# EasyEDA schematic SCH_U-Blox Neo shield for Wemos D1 Mini_2022-02-07.json
TITLE: Sheet_1; REV: 3.0; Date: 2020-07-20; Sheet: 1/1; Drawn By: Danisimo; Company: Your Company
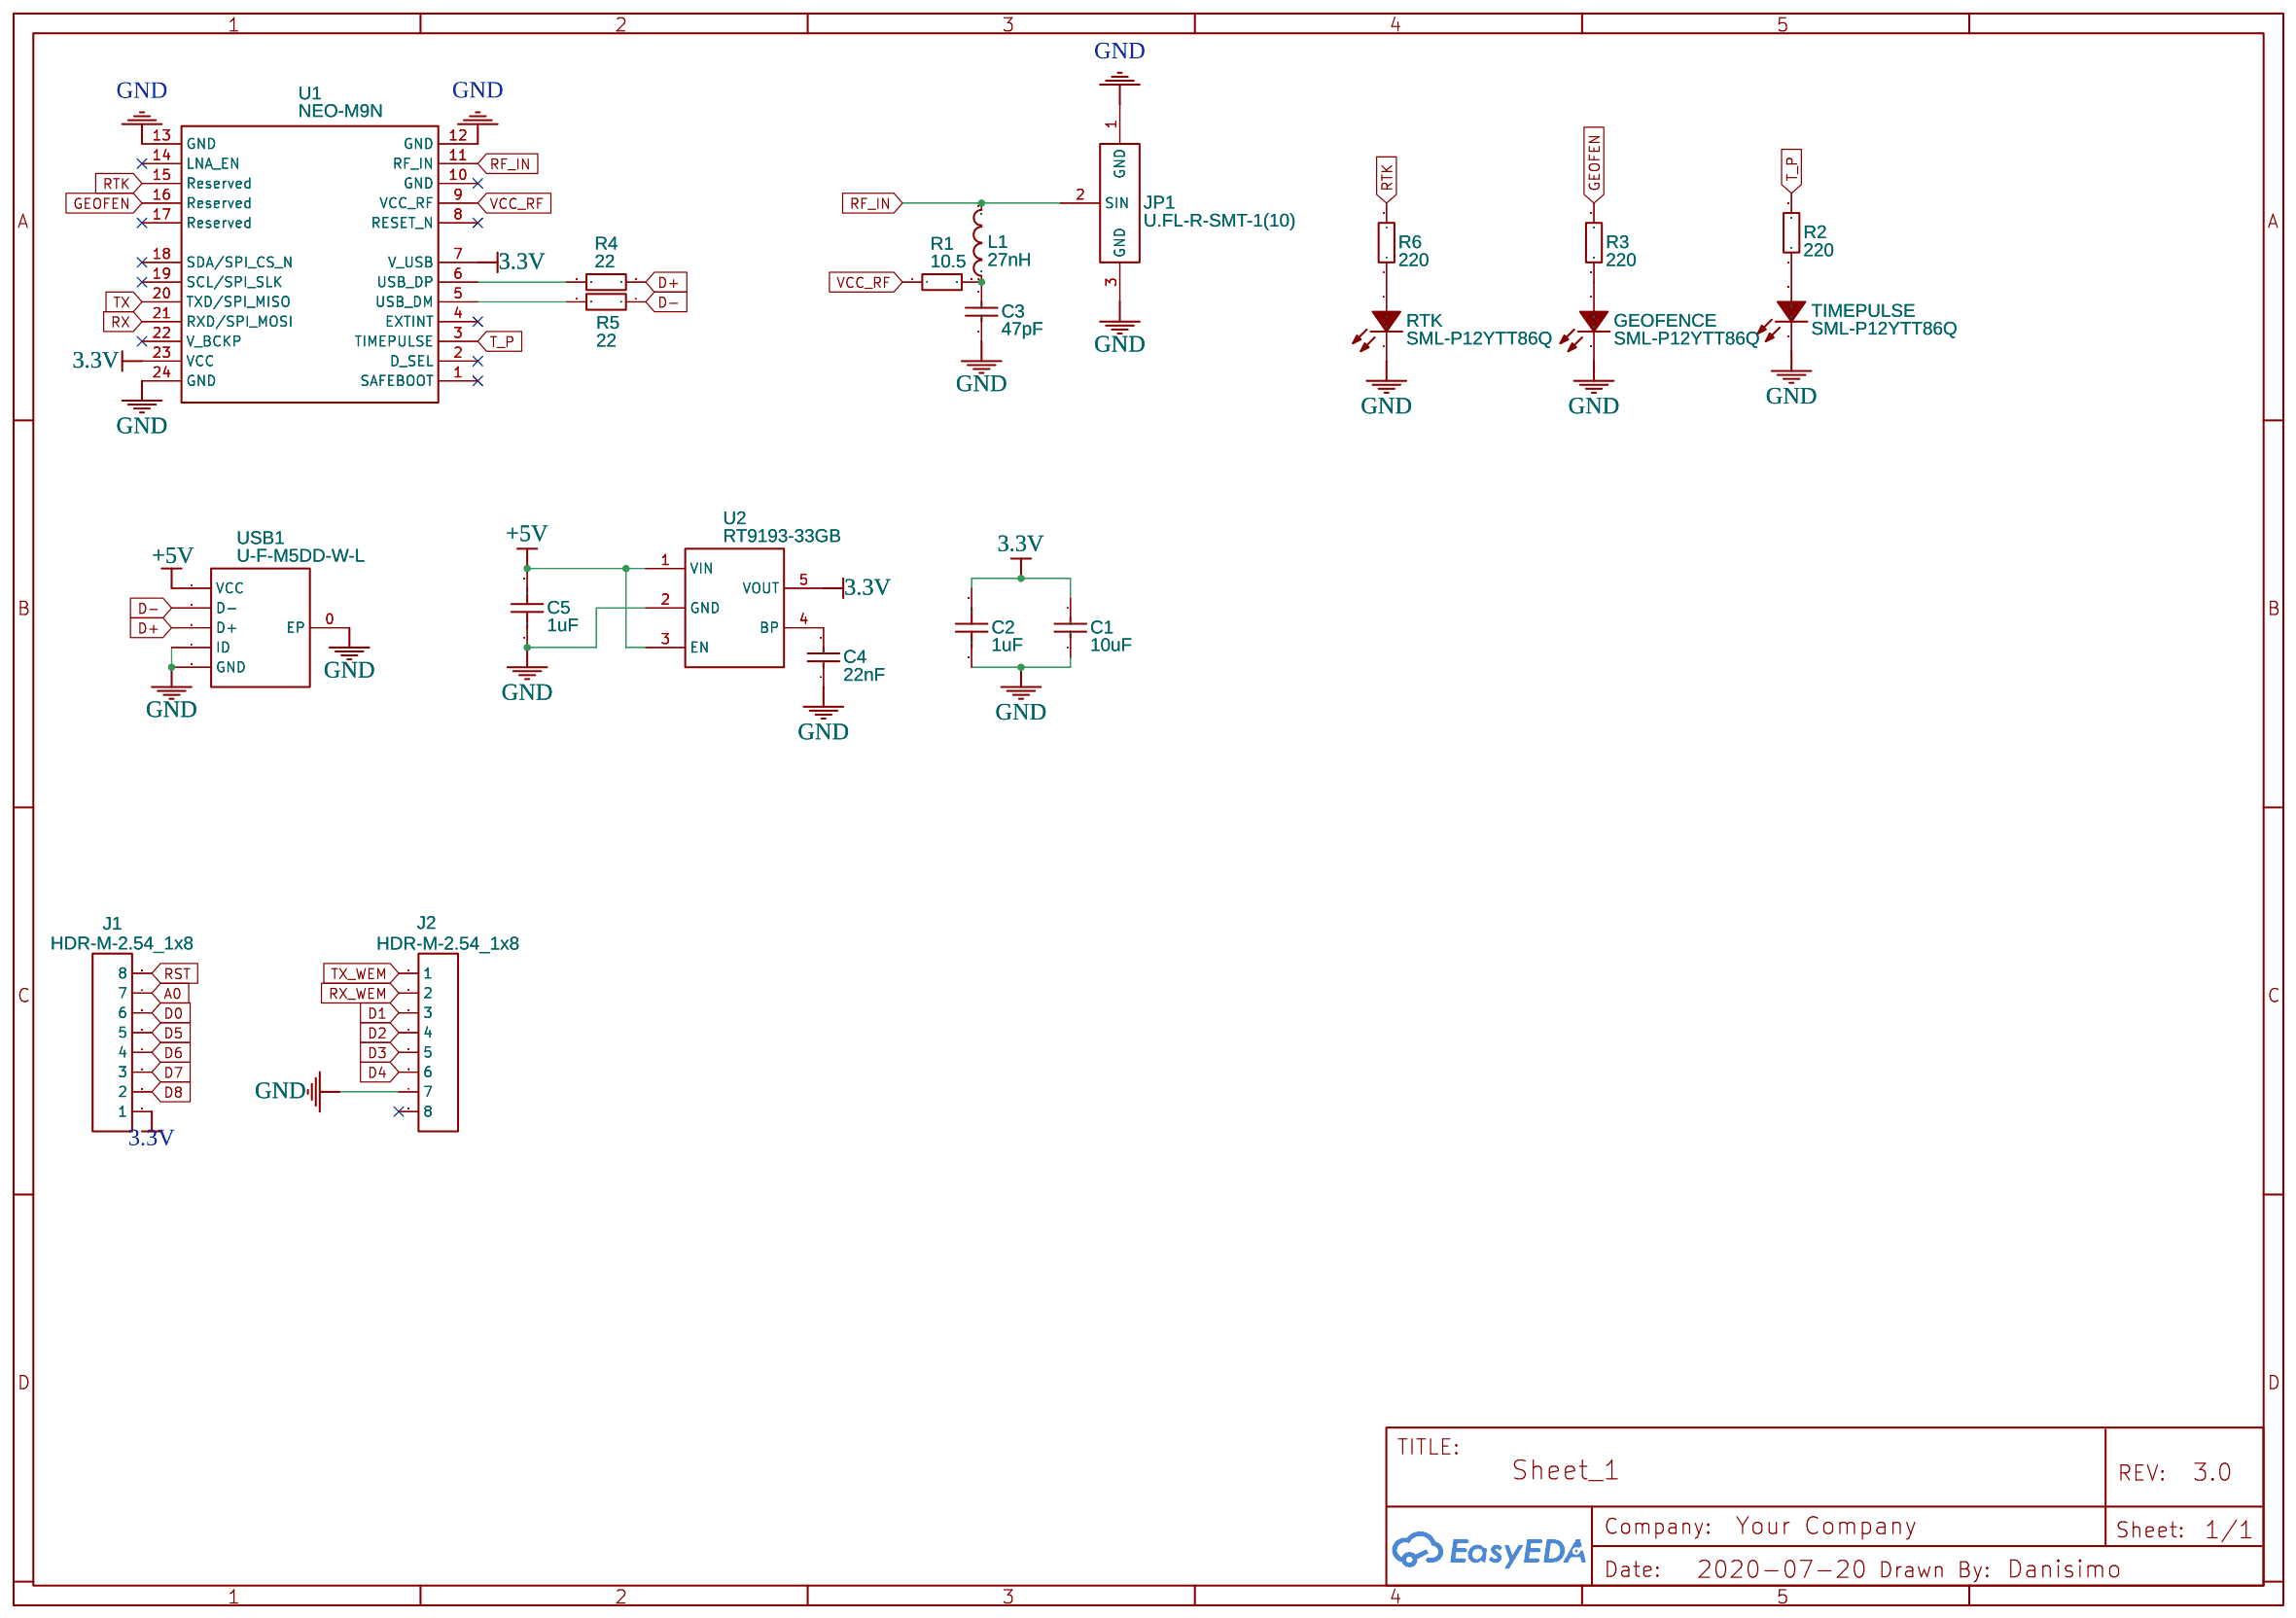
[diagram p0: schematic sheet]

## Parts
C1  10uF  [C0402]
C2  1uF  [C0402]
C3  47pF  [C0402]
C4  22nF  [C0402]
C5  1uF  [C0402]
GEOFENCE  SML-P12YTT86Q  [LED0402-RD]
J1  HDR-M-2.54_1x8  [HDR-M-2.54_1X8]
J2  HDR-M-2.54_1x8  [HDR-M-2.54_1X8]
JP1  U.FL-R-SMT-1(10)  [ANT-SMD_UFL-R-SMT-1(10)]
L1  27nH  [L0402]
R1  10.5  [R0603]
R2  220  [R0402]
R3  220  [R0402]
R4  22  [R0402]
R5  22  [R0402]
R6  220  [R0402]
RTK  SML-P12YTT86Q  [LED0402-RD]
TIMEPULSE  SML-P12YTT86Q  [LED0402-RD]
U1  NEO-M9N  [NEO-M9N]
U2  RT9193-33GB  [SOT-23-5_L3.0-W1.7-P0.95-LS2.8-BR]
USB1  U-F-M5DD-W-L  [MICRO-USB-SMD_MICRO-USB-18]

## Library data of the parts
C1 = CL05A106MQ5NUNC: Supplier: LCSC; Manufacturer: SAMSUNG; LCSC Assembly: Yes; Supplier Part: C15525; SMT Type: Basic
C2 C5 = CL05A105KA5NQNC: Supplier: LCSC; Manufacturer: SAMSUNG; LCSC Assembly: Yes; Supplier Part: C52923; SMT Type: Basic
C3 = 0402CG470J500NT: Supplier: LCSC; Manufacturer: FH; LCSC Assembly: Yes; Supplier Part: C1567; SMT Type: Basic
C4 = 0402B223K500NT: Supplier: LCSC; Manufacturer: FH; LCSC Assembly: Yes; Supplier Part: C1532; SMT Type: Basic
GEOFENCE RTK TIMEPULSE = SML-P12YTT86Q: Supplier: LCSC; Supplier Part: C123071; Manufacturer: ROHM Semicon; Contributor: LCSC; LCSC Assembly: Yes; SMT Type: Extend
J1 J2 = HDR-M-2.54_1x8: Supplier Part: C190820; Supplier: LCSC; Contributor: LCEDA_Lib
JP1 = U.FL-R-SMT-1(10): Supplier: LCSC; Manufacturer: HRS; Supplier Part: C88373
L1 = SDCL1005C27NJTDF: Supplier: LCSC; Manufacturer: Sunlord; LCSC Assembly: Yes; Supplier Part: C18830; SMT Type: Basic
R1 = 0603WAF105JT5E: Supplier: LCSC; Manufacturer: UniOhm; Supplier Part: C22856; LCSC Assembly: Yes; SMT Type: Extend
R2 R3 R6 = 0402WGF2200TCE: Supplier: LCSC; Manufacturer: UniOhm; LCSC Assembly: Yes; Supplier Part: C25091; SMT Type: Basic
R4 R5 = 0402WGF220JTCE: Supplier: LCSC; Manufacturer: UniOhm; LCSC Assembly: Yes; Supplier Part: C25092; SMT Type: Basic
U1 = NEO-M9N: GPS; Contributor: Arson; Supplier: UBLOX; Manufacturer: UBLOX
U2 = RT9193-33GB: Supplier: LCSC; Manufacturer: RICHTEK; image: //image.lceda.cn/szlcsc/C15651.jpg; Supplier Part: C15651; LCSC Assembly: Yes; SMT Type: Extend
USB1 = U-F-M5DD-W-L: Supplier: LCSC; Manufacturer: HRO; Contributor: LCSC; Supplier Part: C145792; LCSC Assembly: Yes; SMT Type: Extend; Paste Type: expand

## Nets
3.3V: C1.2 C2.2 J1.1 U1.7(V_USB) U1.23(VCC) U2.5(VOUT)
+5V: C5.2 U2.1(VIN) U2.3(EN) USB1.1(VCC)
GND: C1.1 C2.1 C3.1 C4.1 C5.1 GEOFENCE.1 J2.7 JP1.1(GND) JP1.3(GND) RTK.1 TIMEPULSE.1 U1.12(GND) U1.13(GND) U1.24(GND) U2.2(GND) USB1.0(EP) USB1.4(ID) USB1.5(GND)
VCC_RF: R1.1 U1.9(VCC_RF)
A0: J1.7
D0: J1.6
D1: J2.3
D2: J2.4
D3: J2.5
D4: J2.6
D5: J1.5
D6: J1.4
D7: J1.3
D8: J1.2
D+: R4.2 USB1.3(D+)
D-: R5.1 USB1.2(D-)
GEOFEN: R3.2 U1.16(Reserved)
RF_IN: JP1.2(SIN) L1.2 U1.11(RF_IN)
RST: J1.8
RTK: R6.2 U1.15(Reserved)
RX: U1.21(RXD/SPI MOSI)
RX_WEM: J2.2
T_P: R2.2 U1.3(TIMEPULSE)
TX: U1.20(TXD/SPI MISO)
TX_WEM: J2.1
Net-(C3-2): C3.2 L1.1 R1.2
Net-(C4-2): C4.2 U2.4(BP)
Net-(GEOFENCE-2): GEOFENCE.2 R3.1
Net-(R2-1): R2.1 TIMEPULSE.2
Net-(R4-1): R4.1 U1.6(USB_DP)
Net-(R5-2): R5.2 U1.5(USB_DM)
Net-(R6-1): R6.1 RTK.2

Not connected (* = marked no-connect by the designer): J2 8*; U1 1(SAFEBOOT)* 2(D_SEL)* 4(EXTINT)* 8(RESET_N)* 10(GND)* 14(LNA_EN)* 17(Reserved)* 18(SDA/SPI CS_N)* 19(SCL/SPI SLK)* 22(V_BCKP)*
